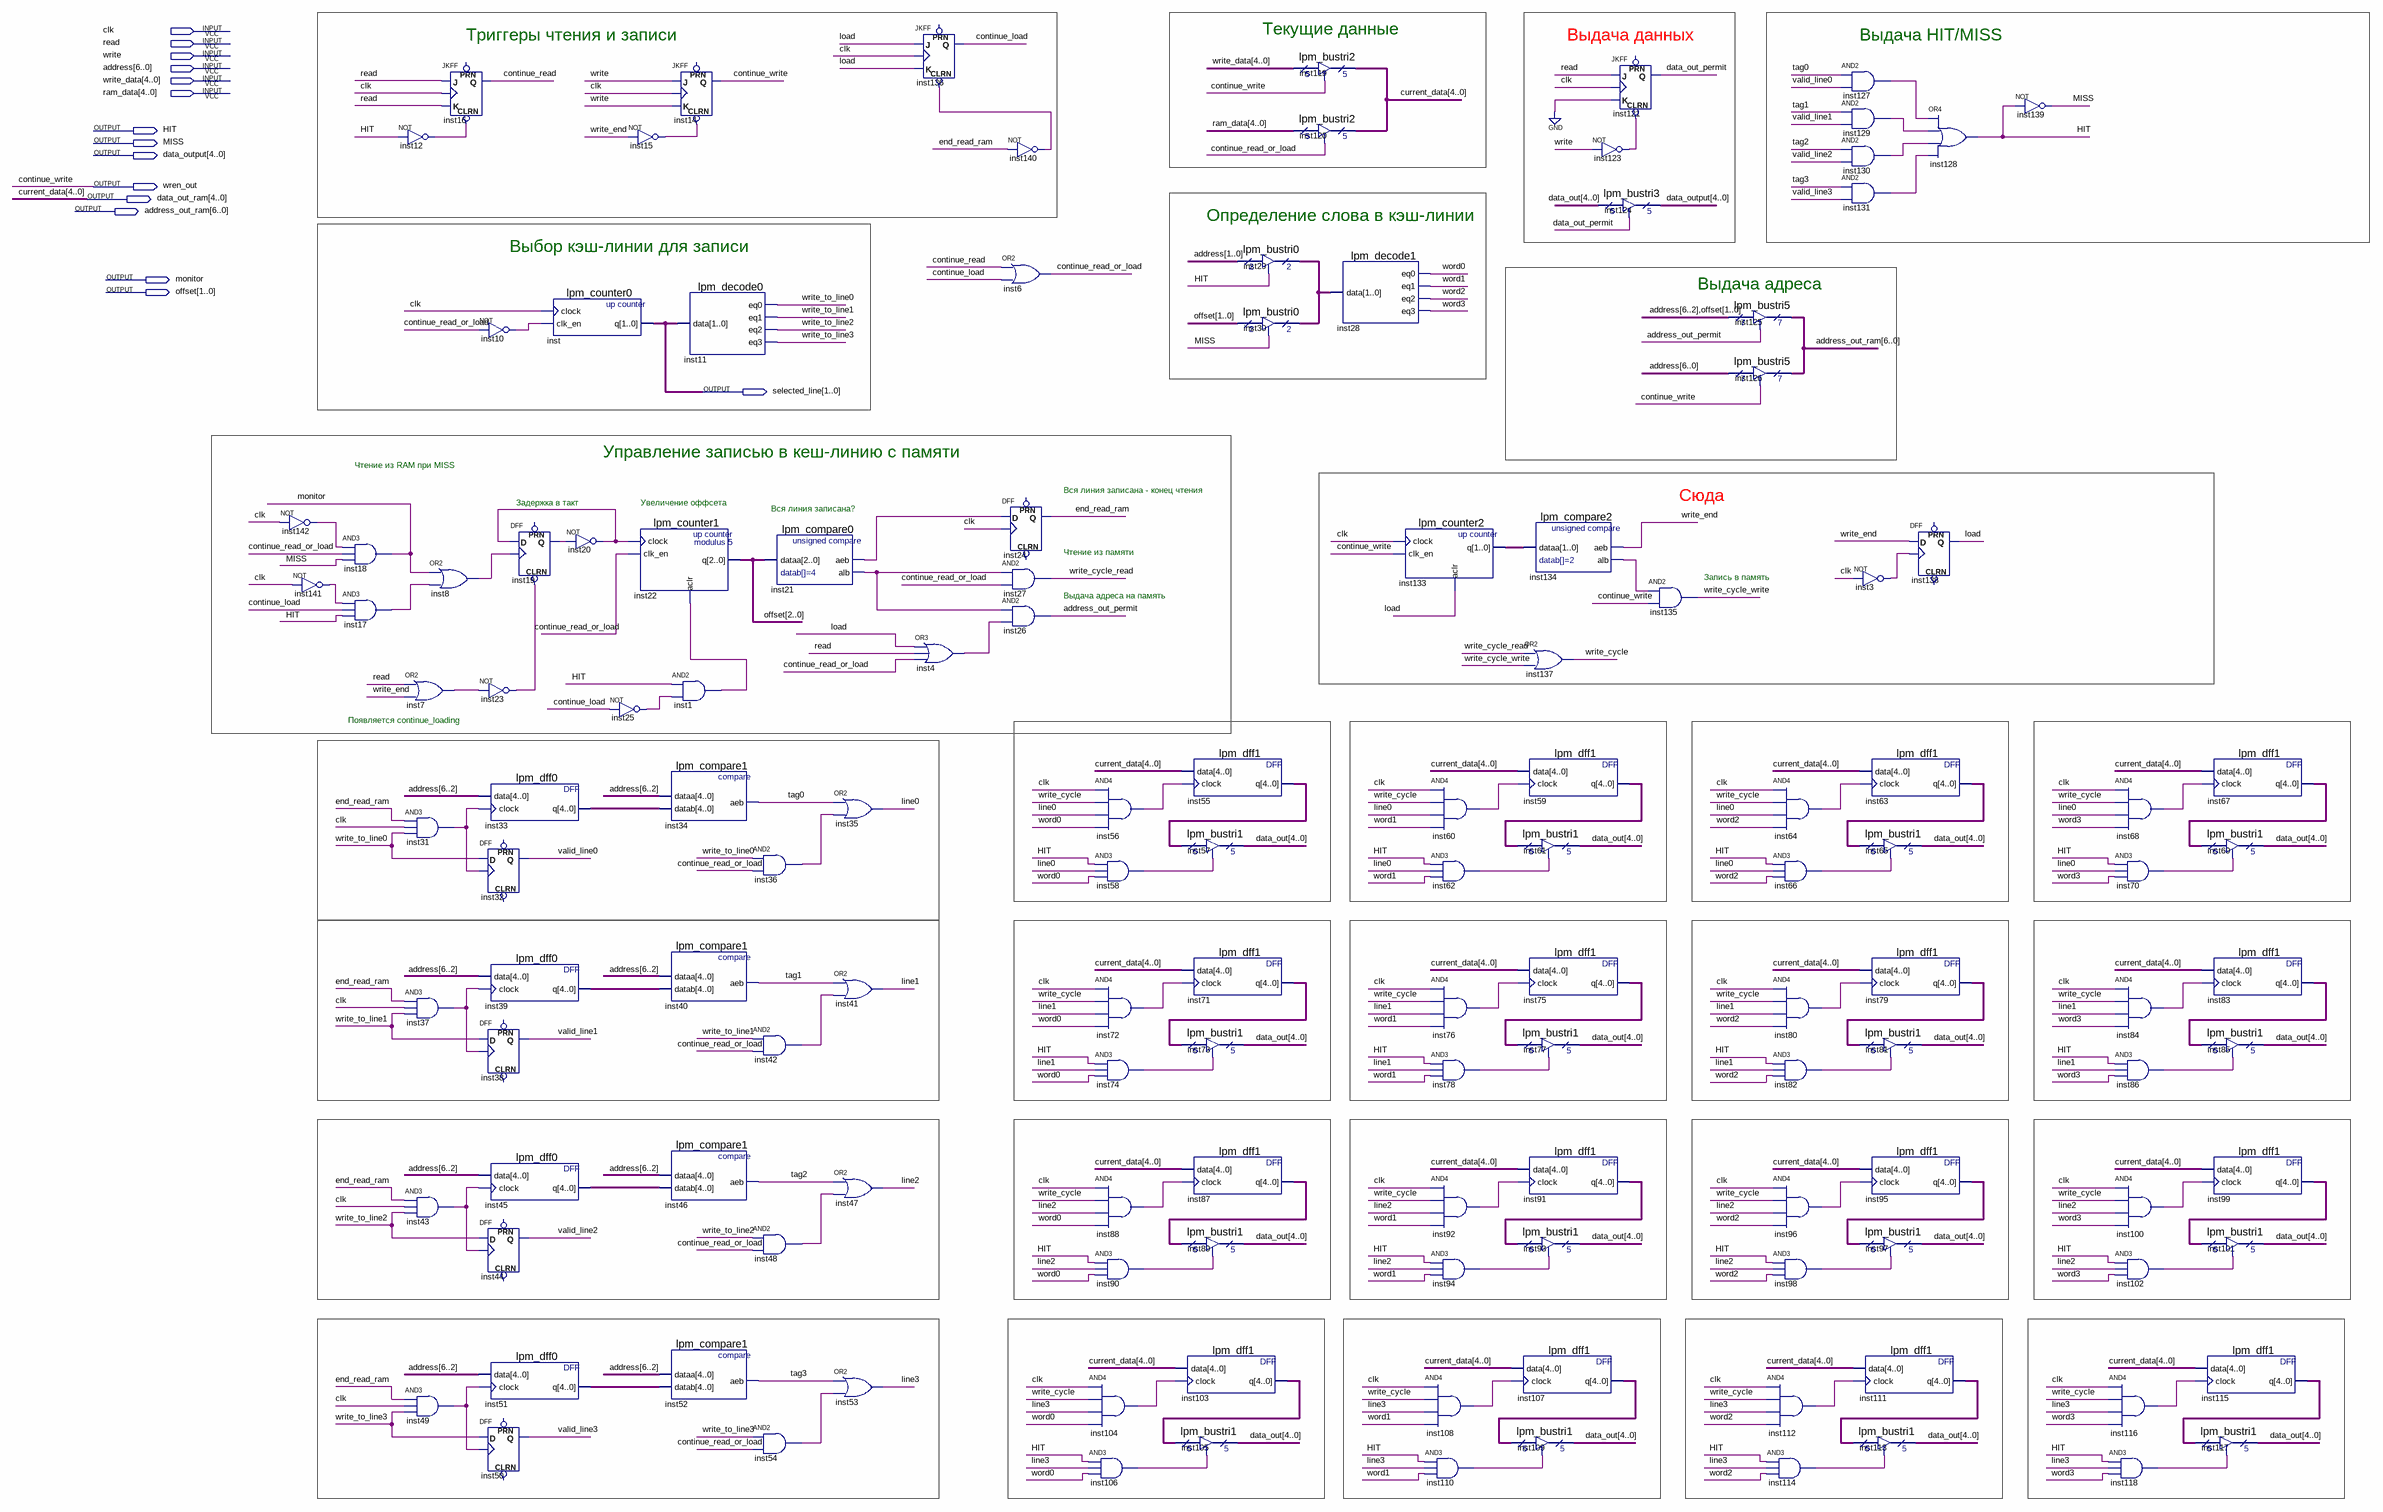
[diagram p0: schematic sheet]
// Quartus schematic cache.bdf as structural Verilog: 137 symbols, 15 pins
module cache (
  input  clk,
  input  read,
  input  write,
  input  [6:0] address,
  input  [4:0] write_data,
  input  [4:0] ram_data,
  output HIT,
  output MISS,
  output [4:0] data_output,
  output wren_out,
  output [4:0] data_out_ram,
  output [6:0] address_out_ram,
  output monitor,
  output [2:0] offset,
  output [1:0] selected_line
);

  wire address_out_permit, continue_load, continue_read, continue_read_or_load, data_out_permit,
       end_read_ram, inst1_out, inst3_out, inst4_out, inst7_out, inst8_out, inst10_out, inst12_out,
       inst15_out, inst17_out, inst19_q, inst20_out, inst21_aeb, inst21_alb, inst23_out, inst25_out,
       inst31_out, inst36_out, inst37_out, inst42_out, inst43_out, inst48_out, inst49_out, inst54_out,
       inst56_out, inst58_out, inst60_out, inst62_out, inst64_out, inst66_out, inst68_out, inst70_out,
       inst72_out, inst74_out, inst76_out, inst78_out, inst80_out, inst82_out, inst84_out, inst86_out,
       inst88_out, inst90_out, inst92_out, inst94_out, inst96_out, inst98_out, inst100_out, inst102_out,
       inst104_out, inst106_out, inst108_out, inst110_out, inst112_out, inst114_out, inst116_out,
       inst118_out, inst123_out, inst127_out, inst129_out, inst130_out, inst131_out, inst134_alb,
       inst140_out, inst141_out, inst142_out, line0, line1, line2, line3, load, tag0, tag1, tag2, tag3,
       valid_line0, valid_line1, valid_line2, valid_line3, word0, word1, word2, word3, write_cycle,
       write_cycle_read, write_cycle_write, write_end, write_to_line0, write_to_line1, write_to_line2,
       write_to_line3;
  wire [1:0] inst29_tridata, inst133_q;
  wire [4:0] data_out, inst33_q, inst39_q, inst45_q, inst51_q, inst55_q, inst59_q, inst63_q, inst67_q,
       inst71_q, inst75_q, inst79_q, inst83_q, inst87_q, inst91_q, inst95_q, inst99_q, inst103_q, inst107_q,
       inst111_q, inst115_q;

  not inst142 (inst142_out, clk);
  not inst141 (inst141_out, clk);
  and inst18 (monitor, inst142_out, continue_read_or_load, MISS);
  and inst17 (inst17_out, inst141_out, continue_load, HIT);
  JKFF inst16 (.CLRN(inst12_out), .K(read), .J(read), .CLK(clk), .Q(continue_read));  // open: PRN
  not inst12 (inst12_out, HIT);
  or inst8 (inst8_out, monitor, inst17_out);
  or inst7 (inst7_out, read, write_end);
  and inst31 (inst31_out, end_read_ram, clk, write_to_line0);
  and inst37 (inst37_out, end_read_ram, clk, write_to_line1);
  and inst43 (inst43_out, end_read_ram, clk, write_to_line2);
  and inst49 (inst49_out, end_read_ram, clk, write_to_line3);
  not inst10 (inst10_out, continue_read_or_load);
  not inst23 (inst23_out, inst7_out);
  lpm_dff0 inst33 (.data(address[6:2]), .clock(inst31_out), .q(inst33_q));
  DFF inst32 (.CLK(inst31_out), .D(write_to_line0), .Q(valid_line0));  // open: CLRN, PRN
  lpm_dff0 inst39 (.data(address[6:2]), .clock(inst37_out), .q(inst39_q));
  DFF inst38 (.CLK(inst37_out), .D(write_to_line1), .Q(valid_line1));  // open: CLRN, PRN
  lpm_dff0 inst45 (.data(address[6:2]), .clock(inst43_out), .q(inst45_q));
  DFF inst44 (.CLK(inst43_out), .D(write_to_line2), .Q(valid_line2));  // open: CLRN, PRN
  lpm_dff0 inst51 (.data(address[6:2]), .clock(inst49_out), .q(inst51_q));
  DFF inst50 (.CLK(inst49_out), .D(write_to_line3), .Q(valid_line3));  // open: CLRN, PRN
  lpm_counter0 inst (.clock(clk), .clk_en(inst10_out), .q(selected_line));
  DFF inst19 (.CLRN(inst23_out), .CLK(inst8_out), .D(inst20_out), .Q(inst19_q));  // open: PRN
  not inst20 (inst20_out, inst19_q);
  not inst15 (inst15_out, write_end);
  lpm_counter1 inst22 (.clock(inst20_out), .clk_en(continue_read_or_load), .aclr(inst1_out), .q(offset));
  not inst25 (inst25_out, continue_load);
  JKFF inst14 (.CLRN(inst15_out), .K(write), .J(write), .CLK(clk), .Q(wren_out));  // open: PRN
  lpm_decode0 inst11 (
    .data(selected_line), .eq0(write_to_line0), .eq1(write_to_line1), .eq2(write_to_line2),
    .eq3(write_to_line3));
  and inst1 (inst1_out, HIT, inst25_out);
  lpm_compare1 inst34 (.dataa(address[6:2]), .datab(inst33_q), .aeb(tag0));
  lpm_compare1 inst40 (.dataa(address[6:2]), .datab(inst39_q), .aeb(tag1));
  lpm_compare1 inst46 (.dataa(address[6:2]), .datab(inst45_q), .aeb(tag2));
  lpm_compare1 inst52 (.dataa(address[6:2]), .datab(inst51_q), .aeb(tag3));
  lpm_compare0 inst21 (.dataa(offset), .aeb(inst21_aeb), .alb(inst21_alb));
  and inst36 (inst36_out, write_to_line0, continue_read_or_load);
  and inst42 (inst42_out, write_to_line1, continue_read_or_load);
  and inst48 (inst48_out, write_to_line2, continue_read_or_load);
  and inst54 (inst54_out, write_to_line3, continue_read_or_load);
  or inst35 (line0, tag0, inst36_out);
  or inst41 (line1, tag1, inst42_out);
  or inst47 (line2, tag2, inst48_out);
  or inst53 (line3, tag3, inst54_out);
  JKFF inst136 (.CLRN(inst140_out), .K(load), .J(load), .CLK(clk), .Q(continue_load));  // open: PRN
  or inst4 (inst4_out, load, read, continue_read_or_load);
  not inst140 (inst140_out, end_read_ram);
  or inst6 (continue_read_or_load, continue_read, continue_load);
  DFF inst24 (.CLK(clk), .D(inst21_aeb), .Q(end_read_ram));  // open: CLRN, PRN
  and inst27 (write_cycle_read, inst21_alb, continue_read_or_load);
  and inst26 (address_out_permit, inst21_alb, inst4_out);
  and inst104 (inst104_out, clk, write_cycle, line3, word0);
  and inst106 (inst106_out, HIT, line3, word0);
  and inst56 (inst56_out, clk, write_cycle, line0, word0);
  and inst58 (inst58_out, HIT, line0, word0);
  and inst72 (inst72_out, clk, write_cycle, line1, word0);
  and inst74 (inst74_out, HIT, line1, word0);
  and inst88 (inst88_out, clk, write_cycle, line2, word0);
  and inst90 (inst90_out, HIT, line2, word0);
  lpm_dff1 inst55 (.data(data_out_ram), .clock(inst56_out), .q(inst55_q));
  lpm_bustri1 inst57 (.enabledt(inst58_out), .data(inst55_q), .tridata(data_out));
  lpm_dff1 inst71 (.data(data_out_ram), .clock(inst72_out), .q(inst71_q));
  lpm_bustri1 inst73 (.enabledt(inst74_out), .data(inst71_q), .tridata(data_out));
  lpm_dff1 inst87 (.data(data_out_ram), .clock(inst88_out), .q(inst87_q));
  lpm_bustri1 inst89 (.enabledt(inst90_out), .data(inst87_q), .tridata(data_out));
  lpm_dff1 inst103 (.data(data_out_ram), .clock(inst104_out), .q(inst103_q));
  lpm_bustri1 inst105 (.enabledt(inst106_out), .data(inst103_q), .tridata(data_out));
  lpm_bustri0 inst29 (.enabledt(HIT), .data(address[1:0]), .tridata(inst29_tridata));
  lpm_bustri0 inst30 (.enabledt(MISS), .data(offset[1:0]), .tridata(inst29_tridata));
  lpm_bustri2 inst119 (.enabledt(wren_out), .data(write_data), .tridata(data_out_ram));
  lpm_bustri2 inst120 (.enabledt(continue_read_or_load), .data(ram_data), .tridata(data_out_ram));
  lpm_decode1 inst28 (.data(inst29_tridata), .eq0(word0), .eq1(word1), .eq2(word2), .eq3(word3));
  lpm_counter2 inst133 (.clock(clk), .clk_en(wren_out), .aclr(load), .q(inst133_q));
  and inst60 (inst60_out, clk, write_cycle, line0, word1);
  and inst62 (inst62_out, HIT, line0, word1);
  and inst76 (inst76_out, clk, write_cycle, line1, word1);
  and inst78 (inst78_out, HIT, line1, word1);
  and inst92 (inst92_out, clk, write_cycle, line2, word1);
  and inst94 (inst94_out, HIT, line2, word1);
  and inst108 (inst108_out, clk, write_cycle, line3, word1);
  and inst110 (inst110_out, HIT, line3, word1);
  lpm_compare2 inst134 (.dataa(inst133_q), .aeb(write_end), .alb(inst134_alb));
  or inst137 (write_cycle, write_cycle_read, write_cycle_write);
  lpm_dff1 inst59 (.data(data_out_ram), .clock(inst60_out), .q(inst59_q));
  lpm_bustri1 inst61 (.enabledt(inst62_out), .data(inst59_q), .tridata(data_out));
  lpm_dff1 inst75 (.data(data_out_ram), .clock(inst76_out), .q(inst75_q));
  lpm_bustri1 inst77 (.enabledt(inst78_out), .data(inst75_q), .tridata(data_out));
  lpm_dff1 inst91 (.data(data_out_ram), .clock(inst92_out), .q(inst91_q));
  lpm_bustri1 inst93 (.enabledt(inst94_out), .data(inst91_q), .tridata(data_out));
  lpm_dff1 inst107 (.data(data_out_ram), .clock(inst108_out), .q(inst107_q));
  lpm_bustri1 inst109 (.enabledt(inst110_out), .data(inst107_q), .tridata(data_out));
  JKFF inst121 (.CLRN(inst123_out), .K(1'b0), .J(read), .CLK(clk), .Q(data_out_permit));  // open: PRN
  not inst123 (inst123_out, write);
  lpm_bustri3 inst124 (.enabledt(data_out_permit), .data(data_out), .tridata(data_output));
  and inst135 (write_cycle_write, inst134_alb, wren_out);
  lpm_bustri5 inst125 (.enabledt(address_out_permit), .data({address[6:2], offset[1:0]}), .tridata(address_out_ram));
  lpm_bustri5 inst126 (.enabledt(wren_out), .data(address), .tridata(address_out_ram));
  and inst64 (inst64_out, clk, write_cycle, line0, word2);
  and inst66 (inst66_out, HIT, line0, word2);
  and inst80 (inst80_out, clk, write_cycle, line1, word2);
  and inst82 (inst82_out, HIT, line1, word2);
  and inst96 (inst96_out, clk, write_cycle, line2, word2);
  and inst98 (inst98_out, HIT, line2, word2);
  and inst112 (inst112_out, clk, write_cycle, line3, word2);
  and inst114 (inst114_out, HIT, line3, word2);
  and inst127 (inst127_out, tag0, valid_line0);
  and inst129 (inst129_out, tag1, valid_line1);
  and inst130 (inst130_out, tag2, valid_line2);
  and inst131 (inst131_out, tag3, valid_line3);
  not inst3 (inst3_out, clk);
  lpm_dff1 inst63 (.data(data_out_ram), .clock(inst64_out), .q(inst63_q));
  lpm_bustri1 inst65 (.enabledt(inst66_out), .data(inst63_q), .tridata(data_out));
  lpm_dff1 inst79 (.data(data_out_ram), .clock(inst80_out), .q(inst79_q));
  lpm_bustri1 inst81 (.enabledt(inst82_out), .data(inst79_q), .tridata(data_out));
  lpm_dff1 inst95 (.data(data_out_ram), .clock(inst96_out), .q(inst95_q));
  lpm_bustri1 inst97 (.enabledt(inst98_out), .data(inst95_q), .tridata(data_out));
  lpm_dff1 inst111 (.data(data_out_ram), .clock(inst112_out), .q(inst111_q));
  lpm_bustri1 inst113 (.enabledt(inst114_out), .data(inst111_q), .tridata(data_out));
  or inst128 (HIT, inst127_out, inst129_out, inst130_out, inst131_out);
  DFF inst138 (.CLK(inst3_out), .D(write_end), .Q(load));  // open: CLRN, PRN
  not inst139 (MISS, HIT);
  and inst68 (inst68_out, clk, write_cycle, line0, word3);
  and inst70 (inst70_out, HIT, line0, word3);
  and inst84 (inst84_out, clk, write_cycle, line1, word3);
  and inst86 (inst86_out, HIT, line1, word3);
  and inst100 (inst100_out, clk, write_cycle, line2, word3);
  and inst102 (inst102_out, HIT, line2, word3);
  and inst116 (inst116_out, clk, write_cycle, line3, word3);
  and inst118 (inst118_out, HIT, line3, word3);
  lpm_dff1 inst67 (.data(data_out_ram), .clock(inst68_out), .q(inst67_q));
  lpm_bustri1 inst69 (.enabledt(inst70_out), .data(inst67_q), .tridata(data_out));
  lpm_dff1 inst83 (.data(data_out_ram), .clock(inst84_out), .q(inst83_q));
  lpm_bustri1 inst85 (.enabledt(inst86_out), .data(inst83_q), .tridata(data_out));
  lpm_dff1 inst99 (.data(data_out_ram), .clock(inst100_out), .q(inst99_q));
  lpm_bustri1 inst101 (.enabledt(inst102_out), .data(inst99_q), .tridata(data_out));
  lpm_dff1 inst115 (.data(data_out_ram), .clock(inst116_out), .q(inst115_q));
  lpm_bustri1 inst117 (.enabledt(inst118_out), .data(inst115_q), .tridata(data_out));

  // Other names for the same wires on the sheet: continue_write = wren_out; current_data[4:0] = data_out_ram

  // Notes on the sheet:
  //   Текущие данные
  //   Триггеры чтения и записи
  //   Выдача данных
  //   Выдача HIT/MISS
  //   Определение слова в кэш-линии
  //   Выбор кэш-линии для записи
  //   Выдача адреса
  //   Управление записью в кеш-линию с памяти
  //   Чтение из RAM при MISS
  //   Вся линия записана - конец чтения
  //   Сюда
  //   Задержка в такт
  //   Увеличение оффсета
  //   Вся линия записана?
  //   Чтение из памяти
  //   Запись в память
  //   Выдача адреса на память
  //   Появляется continue_loading
endmodule
